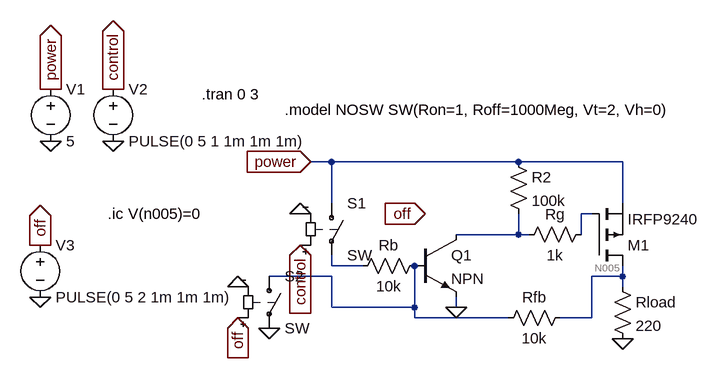
[diagram p0: schematic latch-npn-pmos.asc]
latch-npn-pmos.asc, the LTspice schematic file:
Version 4
SHEET 1 880 680
WIRE -192 48 -224 48
WIRE 96 48 -192 48
WIRE 256 48 96 48
WIRE -192 112 -192 48
WIRE 256 112 256 48
WIRE 208 128 192 128
WIRE 96 160 96 128
WIRE 96 160 0 160
WIRE 112 160 96 160
WIRE 192 160 192 128
WIRE -192 208 -192 192
WIRE -144 208 -192 208
WIRE -192 224 -288 224
WIRE 256 224 256 208
WIRE 256 224 208 224
WIRE 256 240 256 224
WIRE -192 272 -192 224
WIRE -64 272 -64 208
WIRE -64 272 -192 272
WIRE 0 272 0 256
WIRE -64 288 -64 272
WIRE 80 288 -64 288
WIRE 208 288 208 224
WIRE 208 288 160 288
FLAG 256 320 0
FLAG -240 176 control
IOPIN -240 176 In
FLAG -224 48 power
IOPIN -224 48 In
FLAG -624 16 0
FLAG -624 -64 power
IOPIN -624 -64 Out
FLAG -528 16 0
FLAG -528 -64 control
IOPIN -528 -64 Out
FLAG 0 272 0
FLAG -240 128 0
FLAG -640 256 0
FLAG -640 176 off
IOPIN -640 176 Out
FLAG -48 128 off
IOPIN -48 128 In
FLAG -288 304 0
FLAG -336 288 off
IOPIN -336 288 In
FLAG -336 240 0
SYMBOL Res 240 224 R0
SYMATTR InstName Rload
SYMATTR Value 220
SYMBOL Res 208 144 R90
WINDOW 0 0 56 VBottom 2
WINDOW 3 32 56 VTop 2
SYMATTR InstName Rg
SYMATTR Value 1k
SYMBOL Voltage -624 -80 R0
SYMATTR InstName V1
SYMATTR Value 5
SYMBOL Voltage -528 -80 R0
SYMATTR InstName V2
SYMATTR Value PULSE(0 5 1 1m 1m 1m)
SYMBOL npn -64 160 R0
SYMATTR InstName Q1
SYMBOL Res -48 192 R90
WINDOW 0 0 56 VBottom 2
WINDOW 3 32 56 VTop 2
SYMATTR InstName Rb
SYMATTR Value 10k
SYMBOL sw -192 96 R0
SYMATTR InstName S1
SYMATTR SpiceModel NOSW
SYMBOL Res 176 272 R90
WINDOW 0 0 56 VBottom 2
WINDOW 3 32 56 VTop 2
SYMATTR InstName Rfb
SYMATTR Value 10k
SYMBOL sw -288 208 R0
SYMATTR InstName S2
SYMATTR SpiceModel NOSW
SYMBOL Voltage -640 160 R0
SYMATTR InstName V3
SYMATTR Value PULSE(0 5 2 1m 1m 1m)
SYMBOL pmos 208 208 M180
SYMATTR InstName M1
SYMATTR Value IRFP9240
SYMBOL Res 80 32 R0
SYMATTR InstName R2
SYMATTR Value 100k
TEXT -392 -56 Left 2 !.tran 0 3
TEXT -264 -32 Left 2 !.model NOSW SW(Ron=1, Roff=1000Meg, Vt=2, Vh=0)
TEXT -536 128 Left 2 !.ic V(n005)=0

The netlist it stands for:
* latch-npn-pmos.asc
Rload N005 0 220
Rg N001 N002 1k
V1 power 0 5
V2 control 0 PULSE(0 5 1 1m 1m 1m)
Q1 N002 N004 0 0 NPN
Rb N004 N003 10k
S1 power N003 control 0 NOSW SW
Rfb N005 N004 10k
S2 N004 0 off 0 NOSW SW
V3 off 0 PULSE(0 5 2 1m 1m 1m)
M1 N005 N001 power power IRFP9240
R2 power N002 100k
.model NPN NPN
.model PNP PNP
.lib standard.bjt
.model NMOS NMOS
.model PMOS PMOS
.lib standard.mos
.tran 0 3
.model NOSW SW(Ron=1, Roff=1000Meg, Vt=2, Vh=0)
.ic V(n005)=0
.backanno
.end